# EAGLE schematic Top PCB (EAGLE 9.1.0)

## Sheet 1 of 3
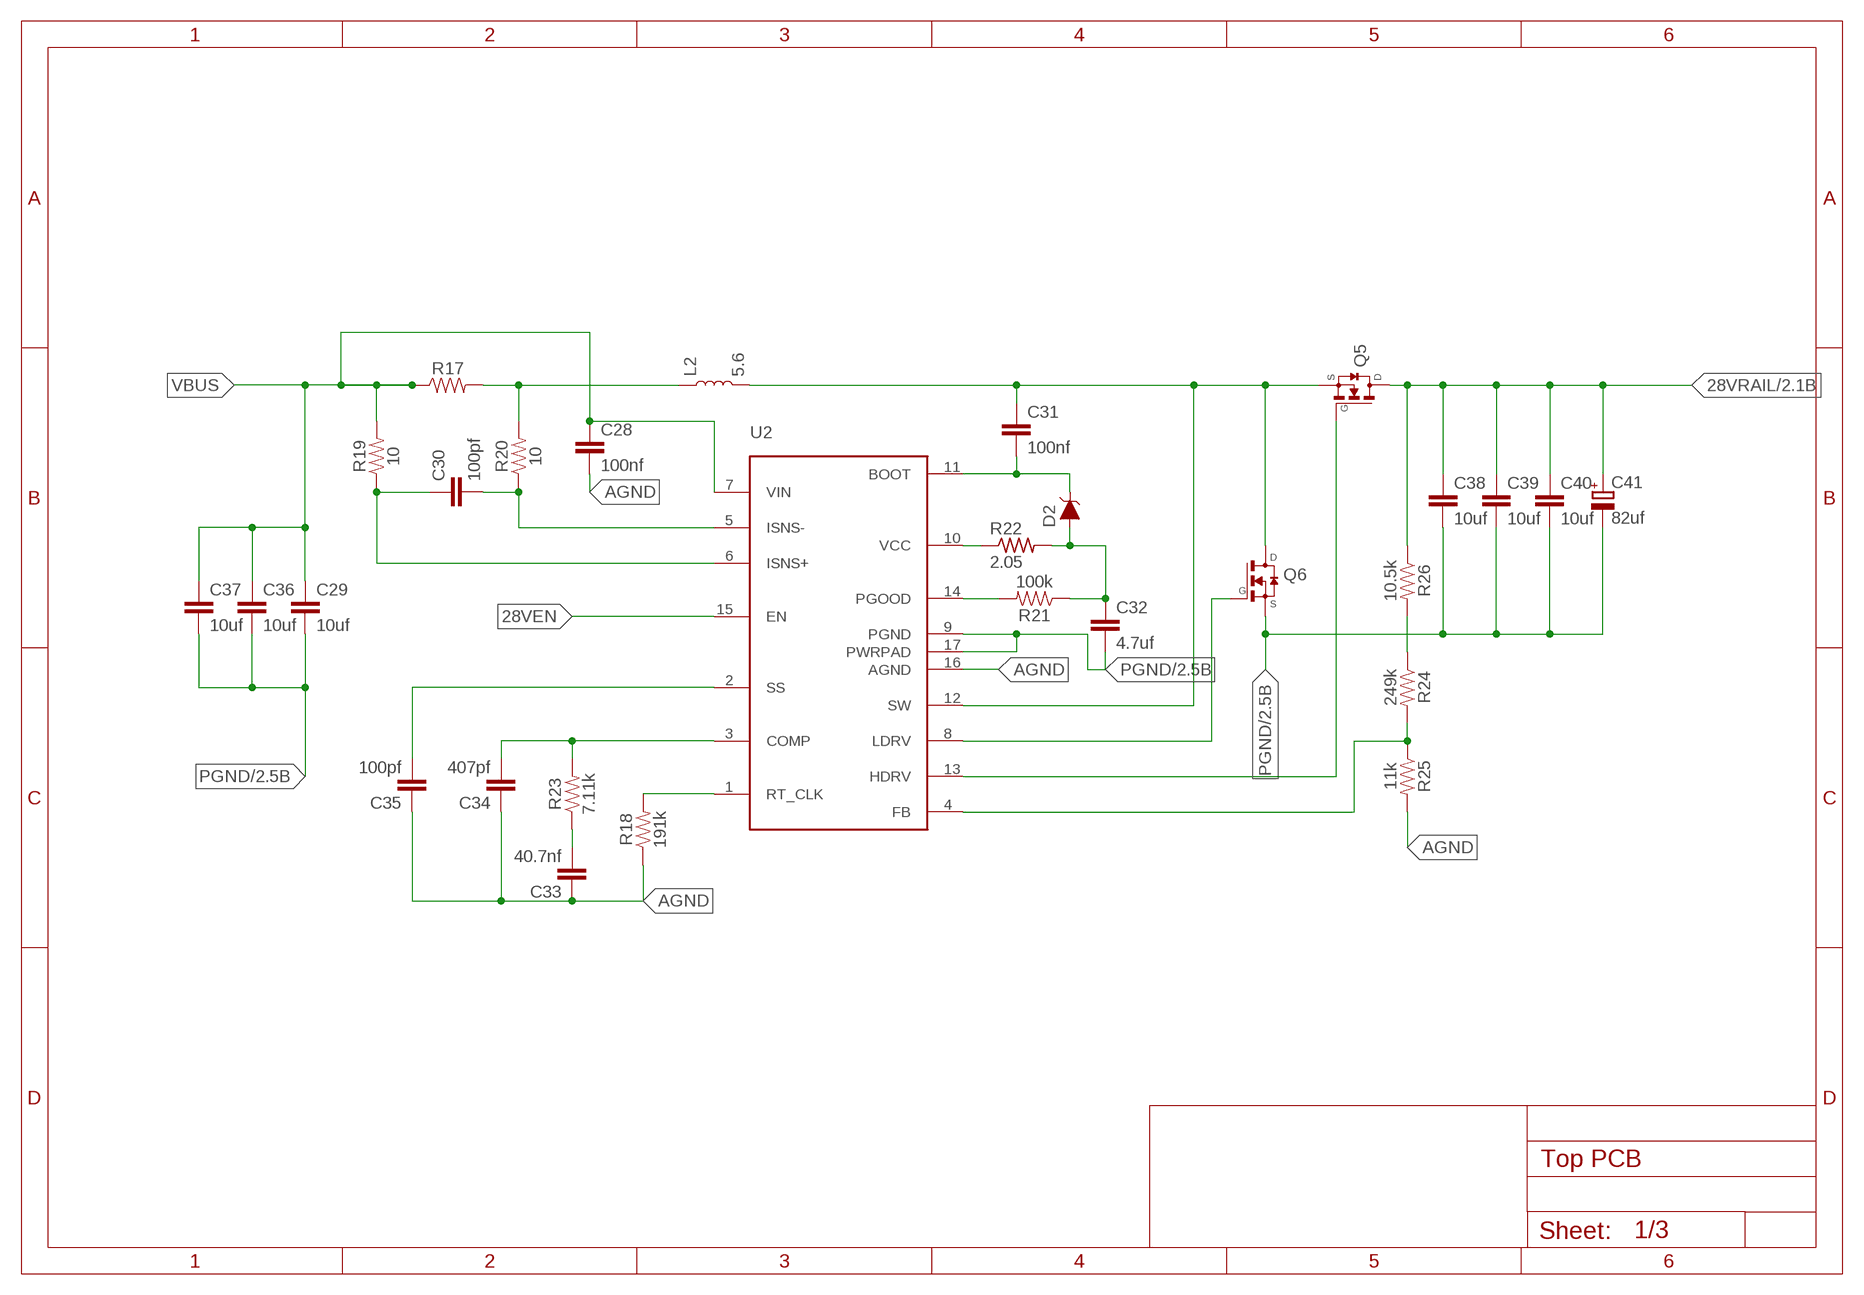
[diagram p0: schematic, sheet 1]

### Parts
C28  100nf  C-EUC0402K  [C0402K]
C29  10uf  C-EUC0805K  [C0805K]
C30  100pf  C-EUC0402K  [C0402K]
C31  100nf  C-EUC0402K  [C0402K]
C32  4.7uf  C-EUC0402K  [C0402K]
C33  40.7nf  C-EUC0402K  [C0402K]
C34  407pf  C-EUC0402K  [C0402K]
C35  100pf  C-EUC0402K  [C0402K]
C36  10uf  C-EUC0805K  [C0805K]
C37  10uf  C-EUC0805K  [C0805K]
C38  10uf  C-EUC0805K  [C0805K]
C39  10uf  C-EUC0805K  [C0805K]
C40  10uf  C-EUC0805K  [C0805K]
C41  82uf  PCR1H820MCL6GS  [CAPAE830X1040]
D2  SS24FL  [SODFL3617X108]
L2  5.6  XAL7070-472MEB  [RESM7275X700]
Q5  SIS184DN-T1-GE3  [SIS184DN-T1-GE3]
Q6  SIS184DN-T1-GE3  [SIS184DN-T1-GE3]
R17  LRMAM2512-R0035FT4  [RESC6432X90]
R18  191k  RES4K04020402  [0402]
R19  10  RES4K04020402  [0402]
R20  10  RES4K04020402  [0402]
R21  100k  RES4K04020402  [0402]
R22  2.05  R-US_R0603  [R0603]
R23  7.11k  RES4K04020402  [0402]
R24  249k  RES4K04020402  [0402]
R25  11k  RES4K04020402  [0402]
R26  10.5k  RES4K04020402  [0402]
U2  TPS43061  [QFN50P300X300X100-17T80X120]

### Nets
28VEN: U2.15(EN)
28VRAIL: C38.1 C39.1 C40.1 C41.1(+) Q5.P$5(D) Q5.P$6(D) Q5.P$7(D) Q5.P$8(D) Q5.P$9(D) R26.1 ; also sheet 2,3
AGND: C28.2 C33.1 C34.1 C35.1 R18.1 R25.2 U2.16(AGND)
N$21: C31.1 L2.2 Q5.P$1(S) Q5.P$2(S) Q5.P$3(S) Q6.P$5(D) Q6.P$6(D) Q6.P$7(D) Q6.P$8(D) Q6.P$9(D) U2.12(SW)
N$22: R24.1 R26.2
N$23: L2.1 R17.2 R20.2
N$24: C30.1 R19.1 U2.6(ISNS+)
N$26: C30.2 R20.1 U2.5(ISNS-)
N$27: C31.2 D2.1(C) U2.11(BOOT)
N$28: C32.1 D2.2(A) R21.1 R22.2
N$29: R21.2 U2.14(PGOOD)
N$30: R22.1 U2.10(VCC)
N$31: R18.2 U2.1(RT_CLK)
N$32: Q5.P$4(G) U2.13(HDRV)
N$33: Q6.P$4(G) U2.8(LDRV)
N$34: R24.2 R25.1 U2.4(FB)
N$35: C34.2 R23.2 U2.3(COMP)
N$36: C33.2 R23.1
N$38: C35.2 U2.2(SS)
PGND: C29.2 C32.2 C36.2 C37.2 C38.2 C39.2 C40.2 C41.2(-) Q6.P$1(S) Q6.P$2(S) Q6.P$3(S) U2.9(PGND) U2.17(PWRPAD) ; also sheet 2,3
VBUS: C28.1 C29.1 C36.1 C37.1 R17.1 R19.2 U2.7(VIN)

## Sheet 2 of 3
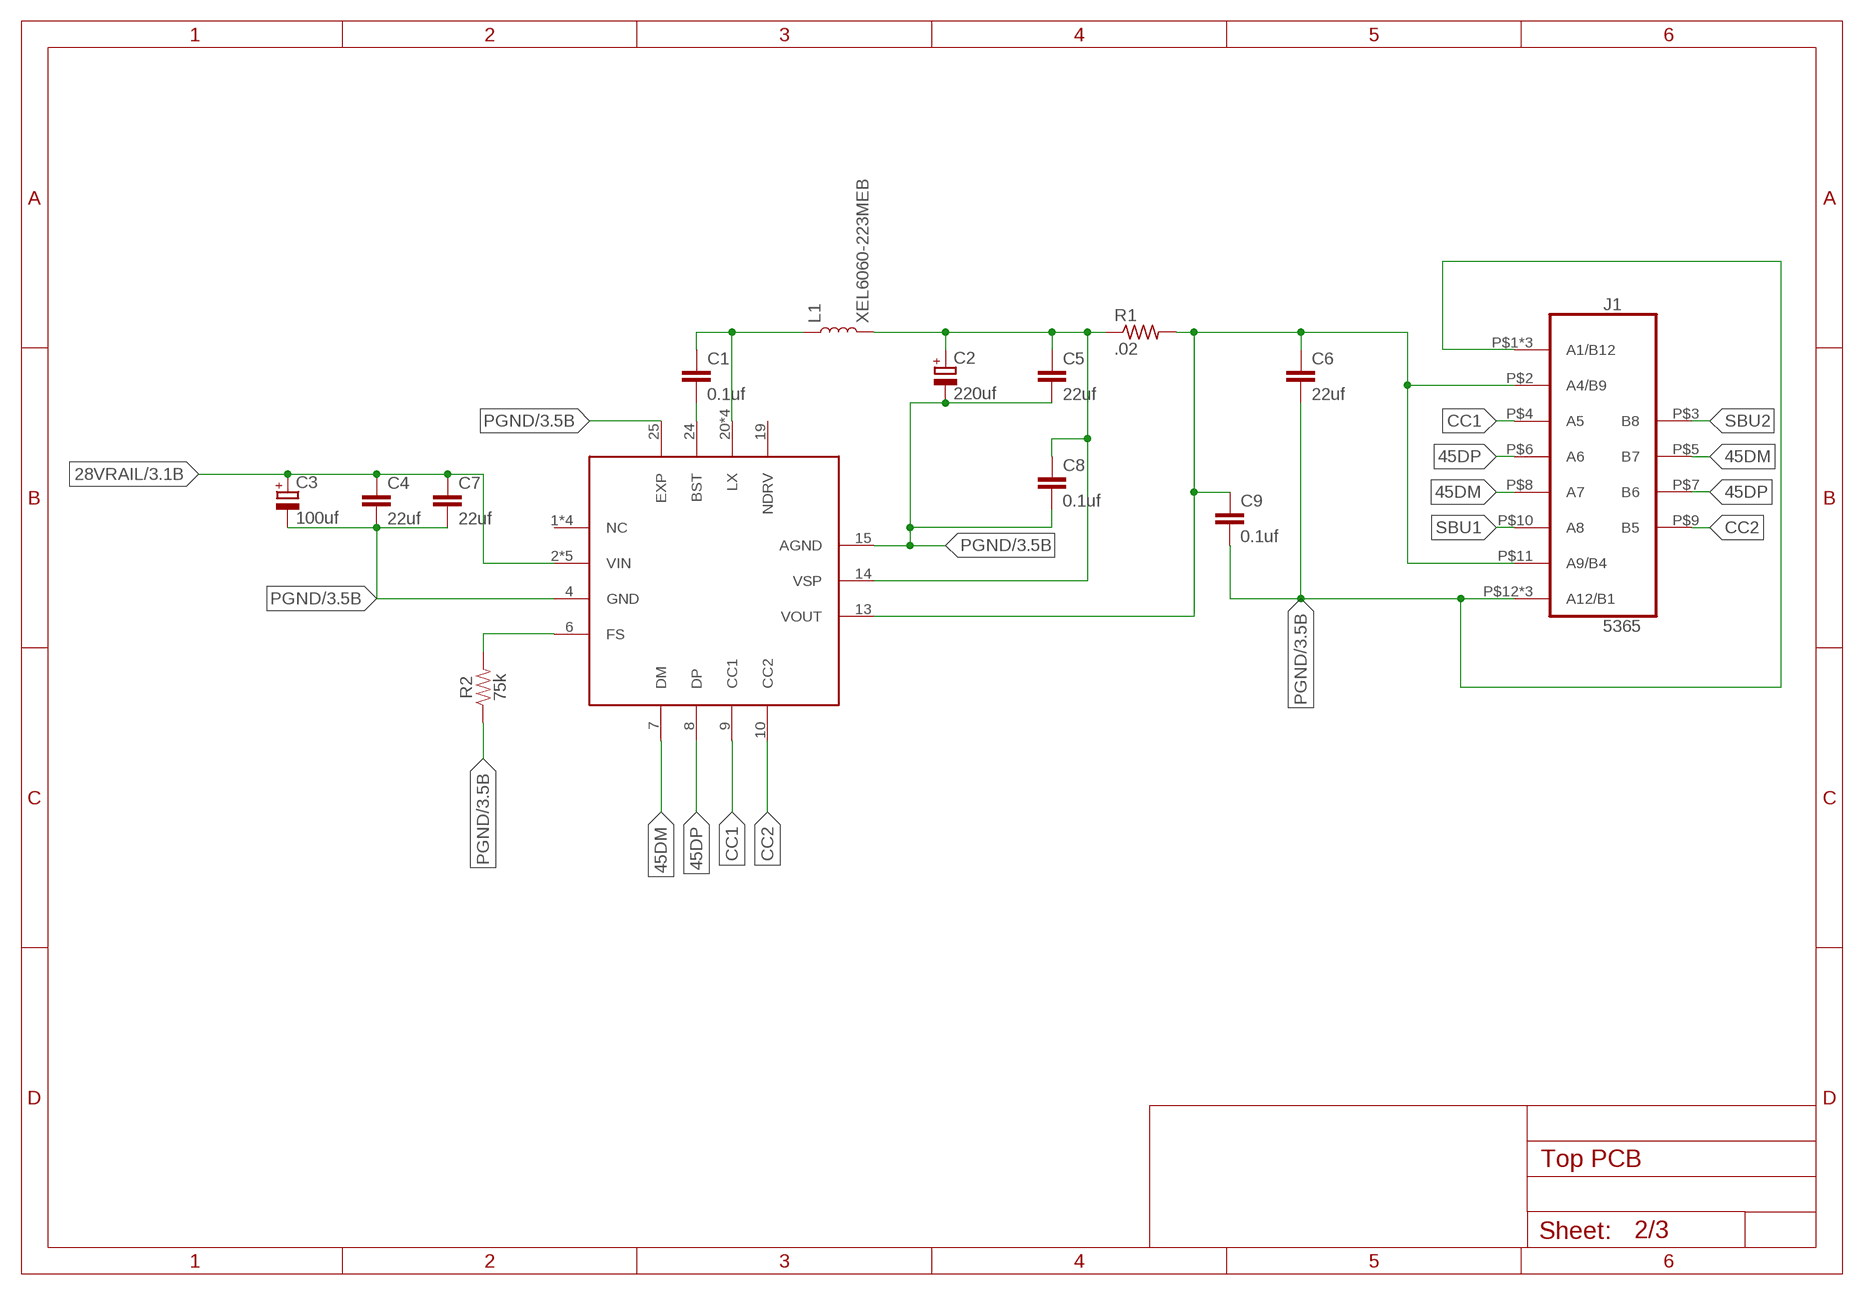
[diagram p1: schematic, sheet 2]

### Parts
C1  0.1uf  C-EUC0805K  [C0805K]
C2  220uf  PCR1H820MCL6GS  [CAPAE830X1040]
C3  100uf  PCR1H820MCL6GS  [CAPAE830X1040]
C4  22uf  C-EUC0805K  [C0805K]
C5  22uf  C-EUC0805K  [C0805K]
C6  22uf  C-EUC0805K  [C0805K]
C7  22uf  C-EUC0805K  [C0805K]
C8  0.1uf  C-EUC0805K  [C0805K]
C9  0.1uf  C-EUC0805K  [C0805K]
J1  5365  [5365]
L1  XEL6060-223MEB  XEL6060-222MEB  [RESM6365X610]
R1  .02  R-US_R0805  [R0805]
R2  75k  RES4K04020402  [0402]
U1  IP6518  [QFN50P400X400X80-25T250]

### Nets
28VRAIL: C3.1(+) C4.1 C7.1 U1.2(VIN) U1.3(VIN) U1.16(VIN) U1.17(VIN) U1.18(VIN) ; also sheet 1,3
45DM: J1.P$5(B7) J1.P$8(A7) U1.7(DM)
45DP: J1.P$6(A6) J1.P$7(B6) U1.8(DP)
CC1: J1.P$4(A5) U1.9(CC1)
CC2: J1.P$9(B5) U1.10(CC2)
N$1: C1.1 L1.1 U1.20(LX) U1.21(LX) U1.22(LX) U1.23(LX)
N$2: C1.2 U1.24(BST)
N$3: C2.1(+) C5.1 C8.1 L1.2 R1.1 U1.14(VSP)
N$5: C6.1 C9.1 J1.P$2(A4/B9) J1.P$11(A9/B4) R1.2 U1.13(VOUT)
N$6: R2.2 U1.6(FS)
PGND: C2.2(-) C3.2(-) C4.2 C5.2 C6.2 C7.2 C8.2 C9.2 J1.P$1(A1/B12) J1.P$12(A12/B1) J1.P$13(A1/B12) J1.P$14(A12/B1) J1.P$15(A1/B12) J1.P$16(A12/B1) R2.1 U1.4(GND) U1.15(AGND) U1.25(EXP) ; also sheet 1,3
SBU1: J1.P$10(A8)
SBU2: J1.P$3(B8)
Unconnected: U1.1(NC) U1.5(NC) U1.11(NC) U1.12(NC) U1.19(NDRV)

## Sheet 3 of 3
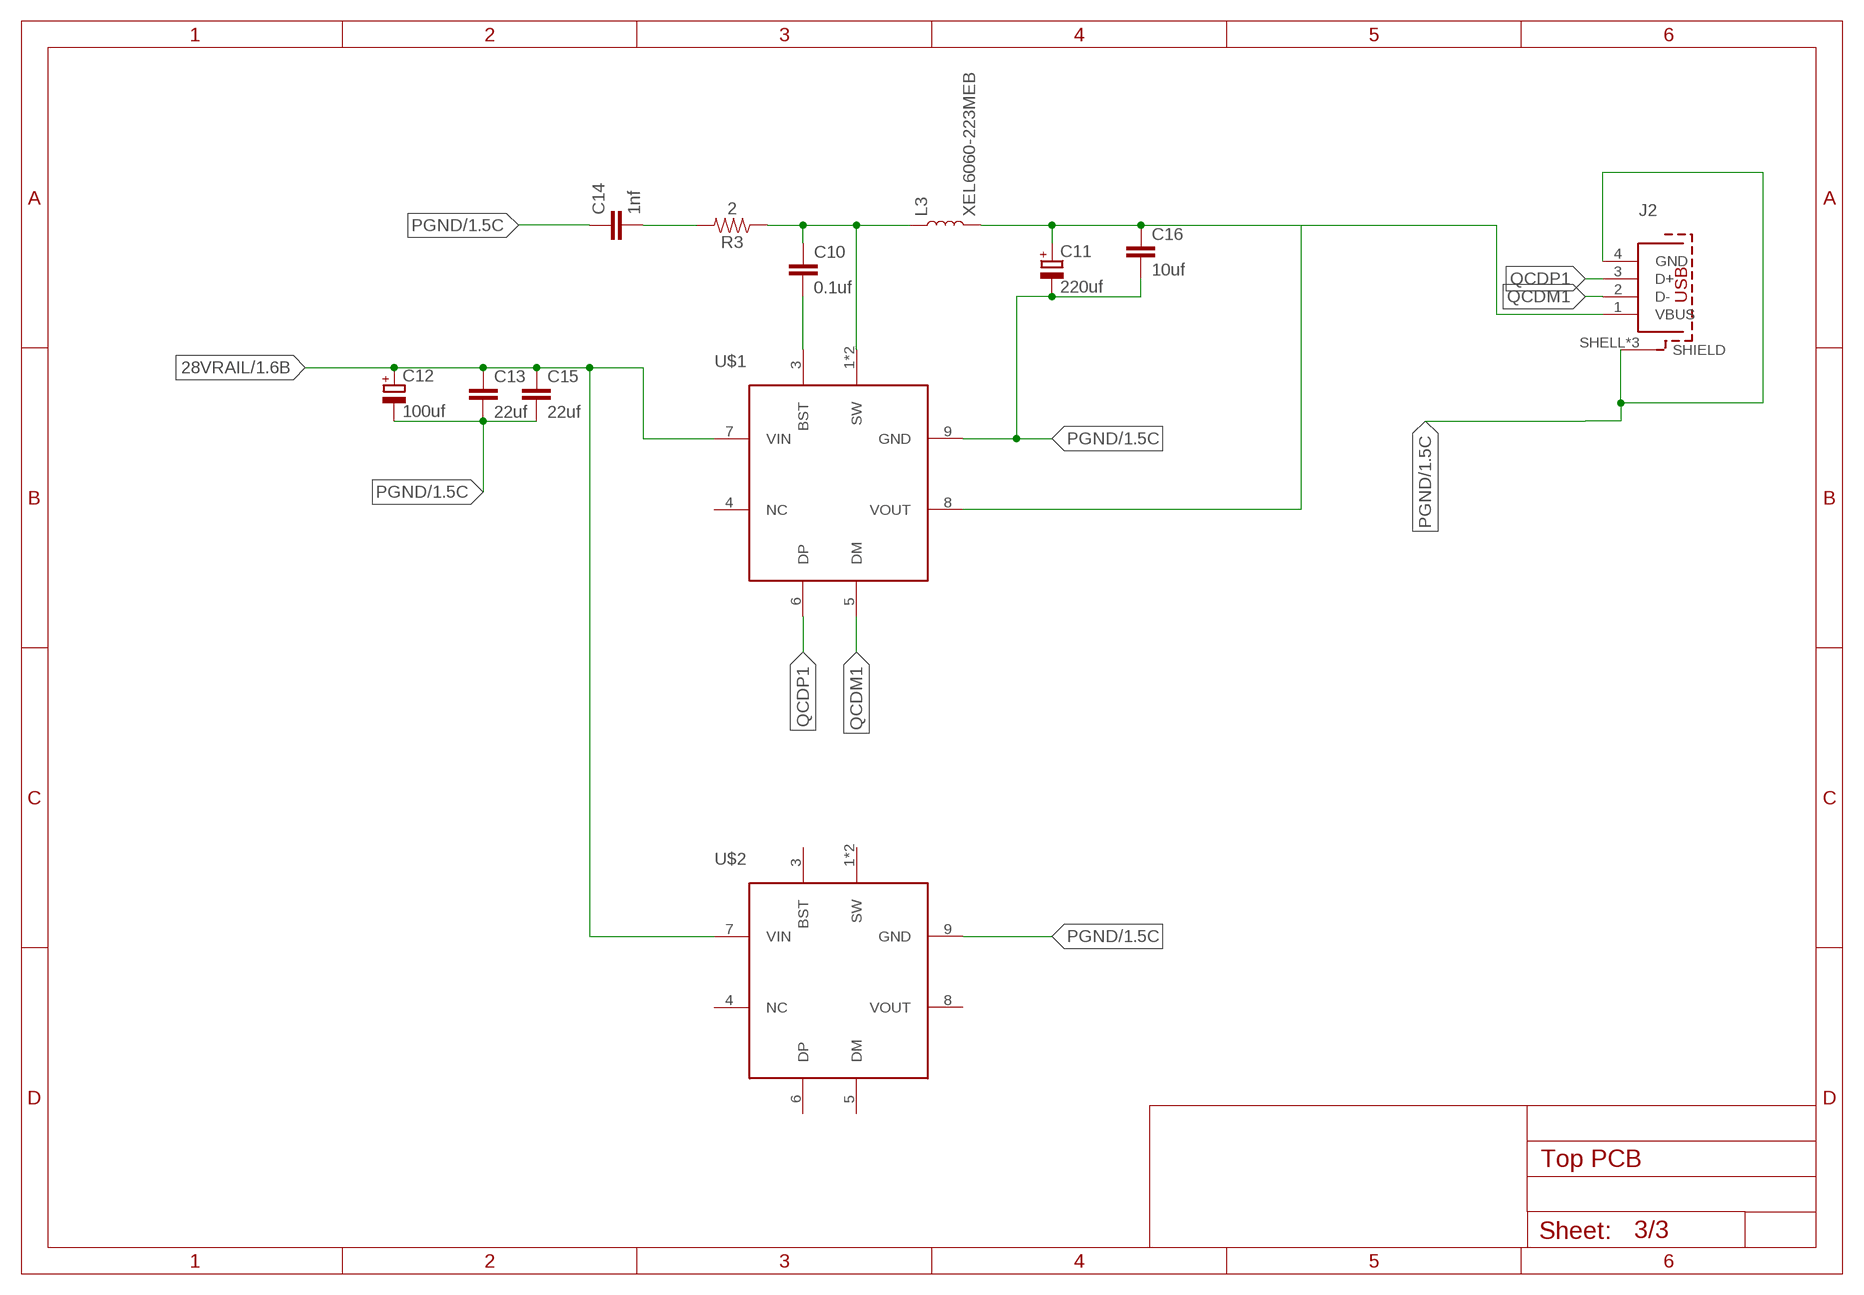
[diagram p2: schematic, sheet 3]

### Parts
C10  0.1uf  C-EUC0805K  [C0805K]
C11  220uf  PCR1H820MCL6GS  [CAPAE830X1040]
C12  100uf  PCR1H820MCL6GS  [CAPAE830X1040]
C13  22uf  C-EUC0805K  [C0805K]
C14  1nf  C-EUC0402K  [C0402K]
C15  22uf  C-EUC0805K  [C0805K]
C16  10uf  C-EUC0805K  [C0805K]
J2  614004184726  [614004184726]
L3  XEL6060-223MEB  XEL6060-222MEB  [RESM6365X610]
R3  2  RES4K04020402  [0402]
U$1  IP6505  [SOIC127P600X165-9T209]
U$2  IP6505  [SOIC127P600X165-9T209]

### Nets
28VRAIL: C12.1(+) C13.1 C15.1 U$1.7(VIN) U$2.7(VIN) ; also sheet 1,2
N$4: C10.1 L3.1 R3.1 U$1.1(SW) U$1.2(SW)
N$7: C10.2 U$1.3(BST)
N$8: C14.2 R3.2
N$9: J2.1(VBUS) U$1.8(VOUT)
N$11: C11.1(+) C16.1 L3.2
PGND: C11.2(-) C12.2(-) C13.2 C14.1 C15.2 C16.2 J2.4(GND) J2.SHELL1(SHIELD) J2.SHELL2(SHIELD) J2.SHELL(SHIELD) U$1.9(GND) U$2.9(GND) ; also sheet 1,2
QCDM1: J2.2(D-) U$1.5(DM)
QCDP1: J2.3(D+) U$1.6(DP)
Unconnected: U$1.4(NC) U$2.1(SW) U$2.2(SW) U$2.3(BST) U$2.4(NC) U$2.5(DM) U$2.6(DP) U$2.8(VOUT)

## Library data of the parts
C1 C4-C10 C13-C16 C28-C40 = rcl:C-EU: CAPACITOR, European symbol; SPICEPREFIX: C
C2 C3 C11 C12 C41 = BMS:PCR1H820MCL6GS
D2 = BMS:SS24FL
J1 = CSD25402Q3A:5365
J2 = CSD25402Q3A:614004184726: USB TYPE A UP RIGHT THT - SHORT TYPE =>ConUSB2 614004184726 Characteristics INSULATOR:PBT FLAMMABILITY RATING: UL94-V0 COLOR: WHITE CONTACT MATERIAL: COPPER ALLOY CONTACT PLATING: GOLD OVER TIN COVER MATERIAL: BRASS COVER PLATING: Ni QUALITY CLASS: 5 000 MATING CYCLES OPERATING TEMPERATURE:-40°C UP TO +85°C COMPLIANCE: LEAD FREE AND ROHS ELECTRICAL CURRENT RATING: 2A WORKING VOLTAGE: 30VAC WITHSTANDING VOLTAGE: 500 VAC/MIN INSULATION RESISTANCE: > 1000 MΩ CONTACT RESISTANCE: 30 mΩ MAX <http://katalog.we-online.de/media/images/v2/Family_WR-COM_614004184726_4C.jpg> Details see: http://katalog.we-online.de/en/em/COM_THT_TYPE_A_UP_RIGHT/614004184726 2015 (C) Wurth Elektronik
L1 L3 = BMS:XEL6060-222MEB
L2 = BMS:XAL7070-472MEB
Q5 Q6 = CSD25402Q3A:SIS184DN-T1-GE3
R1 R22 = rcl:R-US_: RESISTOR, American symbol; SPICEPREFIX: R
R2 R3 R18-R21 R23-R26 = BMS:RES4K0402
R17 = BMS:LRMAM2512-R0035FT4
U1 = BMS:IP6518
U2 = BMS:TPS43061
U$1 U$2 = BMS:IP6505